# EAGLE design Full_PCB (EAGLE 7.1.0)

## Sheet 1 of 2
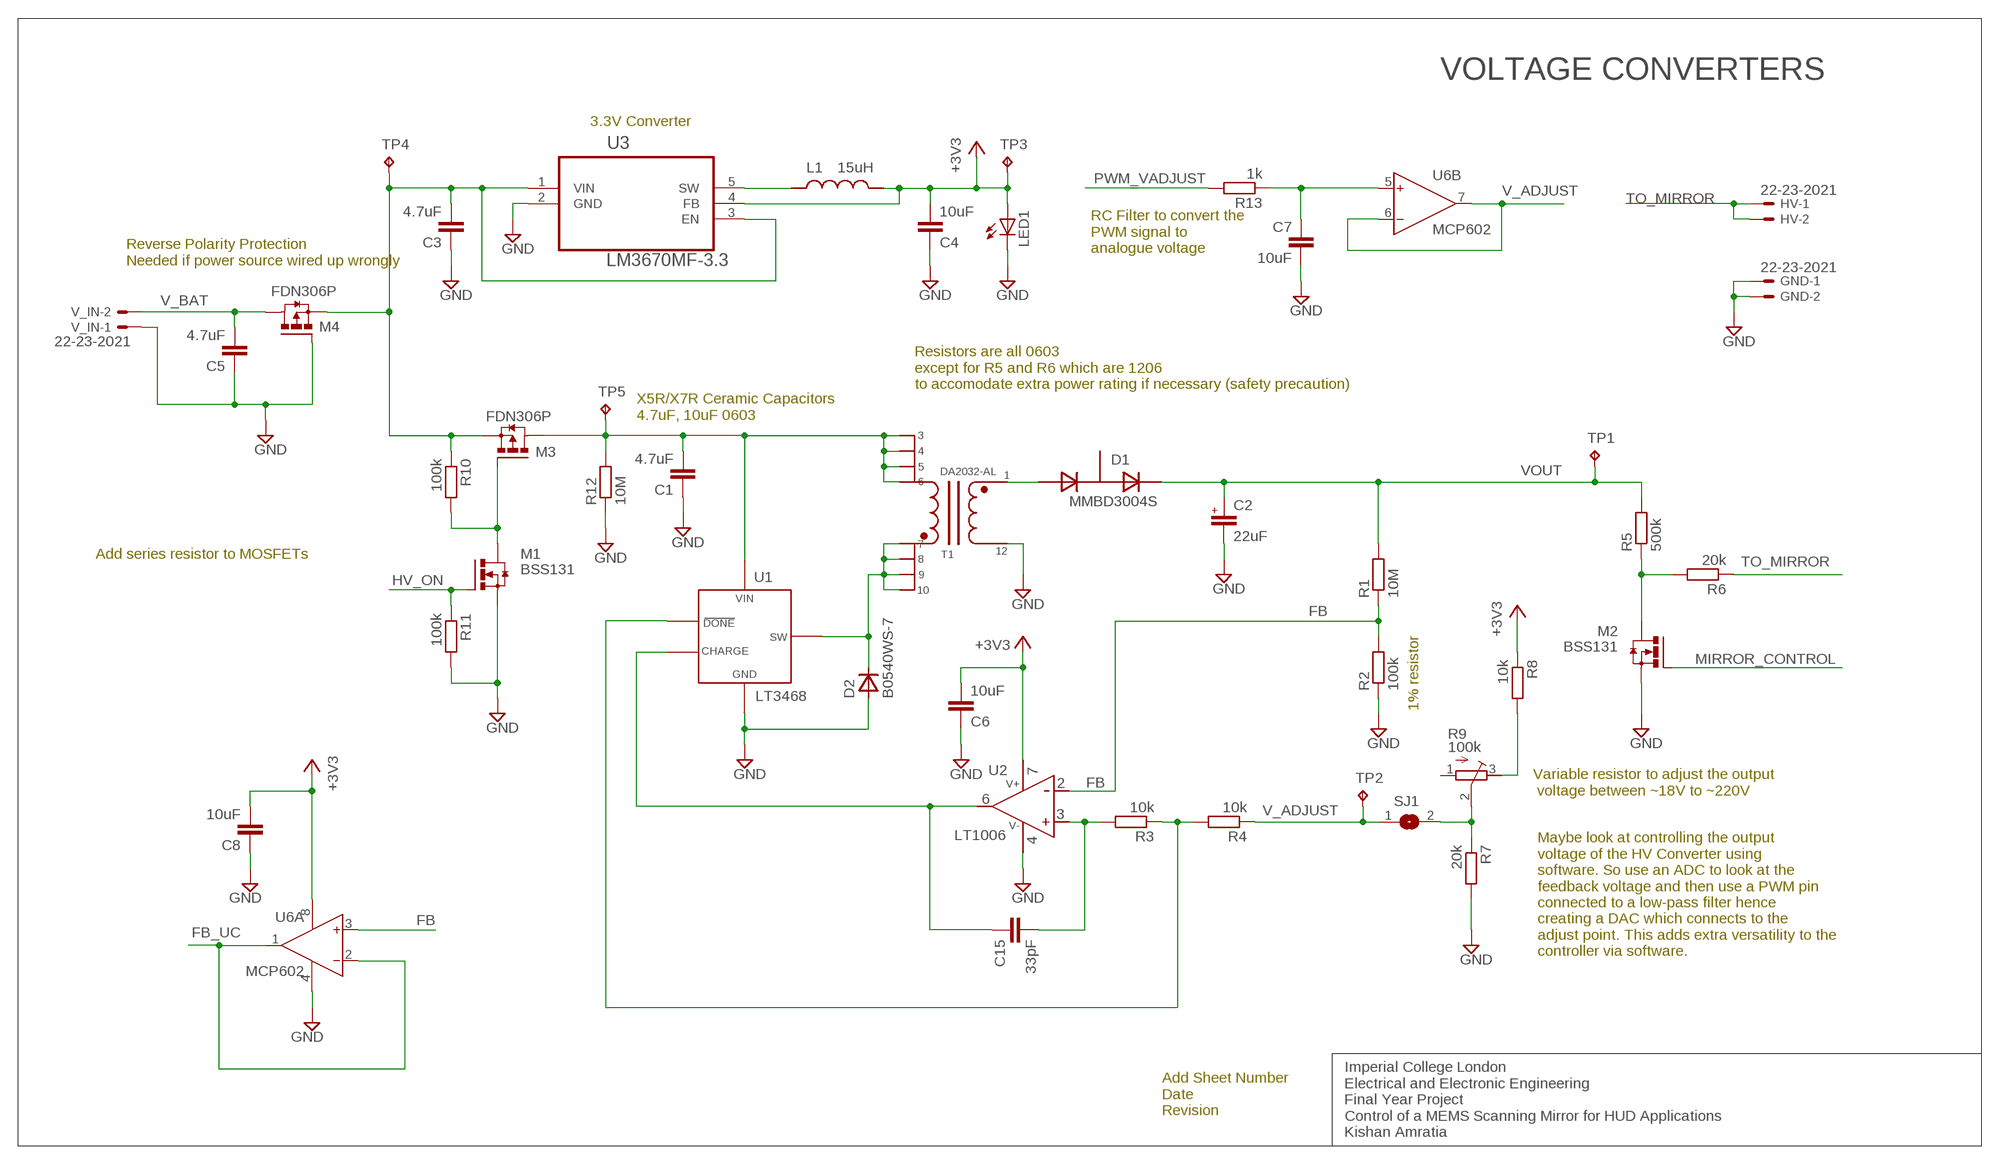
[diagram p0: schematic, sheet 1]

### Parts
C1  4.7uF  C-EUC0603K  [C0603K]
C2  22uF  EEUEE2E220  [5MM-RADIAL-LEAD]
C3  4.7uF  C-EUC0603K  [C0603K]
C4  10uF  C-EUC0603  [C0603]
C5  4.7uF  C-EUC0603K  [C0603K]
C6  10uF  C-EUC0603  [C0603]
C7  10uF  C-EUC0603  [C0603]
C8  10uF  C-EUC0603  [C0603]
C15  33pF  C-EUC0603  [C0603]
D1  MMBD3004S  [SOT-23]
D2  B0540WS-7  [SOD-323]
GND  22-23-2021  [22-23-2021]
HV  22-23-2021  [22-23-2021]
L1  15uH  IFSC1515AHER150M01  [IFSC1515AHER150M01]
LED1  LEDCHIPLED_0603  [CHIPLED_0603]
M1  BSS131  [SOT-23]
M2  BSS131  [SOT-23]
M3  FDN306P  [SSOT-3]
M4  FDN306P  [SSOT-3]
R1  10M  R-EU_R0603  [R0603]
R2  100k  R-EU_R0603  [R0603]
R3  10k  R-EU_R0603  [R0603]
R4  10k  R-EU_R0603  [R0603]
R5  500k  R-EU_R1206  [R1206]
R6  20k  R-EU_R1206  [R1206]
R7  20k  R-EU_R0603  [R0603]
R8  10k  R-EU_R0603  [R0603]
R9  100k  TC33X-2-104E  [TC33X-2-104E]
R10  100k  R-EU_R0603  [R0603]
R11  100k  R-EU_R0603  [R0603]
R12  10M  R-EU_R0603  [R0603]
R13  1k  R-EU_R0603  [R0603]
SJ1  SJ  [SJ]
T1  DA2032-AL  [DA2032-AL]
TP1  TPB1,27  [B1,27]
TP2  TPB1,27  [B1,27]
TP3  TPB1,27  [B1,27]
TP4  TPB1,27  [B1,27]
TP5  TPB1,27  [B1,27]
U1  LT3468  [TSOT-23]
U2  LT1006  [SOIC127P600X175-8N]
U3  LM3670MF-3.3  [SOT95P284X122-5N]
U6  MCP602  [SOIC127P600X175-8N]
V_IN  22-23-2021  [22-23-2021]

### Nets
+3V3: C4.2 C6.2 C8.2 L1.2 LED1.A R8.1 TP3.TP U2.7 U3.4(FB) U6.8(C:V+) ; also sheet 2
FB: R1.1 R2.2 U2.2 U6.3(A:IN+)
FB_UC: U6.1(A:OUT) U6.2(A:IN-) ; also sheet 2
GND: C1.1 C2.2 C3.1 C4.1 C5.1 C6.1 C7.2 C8.1 D2.A GND.1 GND.2 LED1.C M1.K(S) M2.K(S) M4.1(G) R2.1 R7.2 R11.2 R12.1 T1.12 U1.2 U2.4 U3.2(GND) U6.4(C:V-) V_IN.1 ; also sheet 2
HV_ON: M1.A(G) R11.1 ; also sheet 2
MIRROR_CONTROL: M2.A(G) ; also sheet 2
N$1: C7.1 R13.1 U6.5(B:IN+)
N$2: C15.1 U1.4 U2.6
N$3: D1.A T1.1
N$4: R8.2 R9.3
N$5: C1.2 M3.3(D) R12.2 T1.3 T1.4 T1.5 T1.6 TP5.TP U1.5
N$6: R3.1 R4.2 U1.3
N$8: C15.2 R3.2 U2.3
N$9: M2.K1A2(D) R5.1 R6.2
N$10: R7.1 R9.2 SJ1.2
N$12: D2.K T1.7 T1.8 T1.9 T1.10 U1.1
N$13: M1.K1A2(D) M3.1(G) R10.2
N$14: L1.1 U3.5(SW)
PWM_VADJUST: R13.2 ; also sheet 2
TO_MIRROR: HV.1 HV.2 R6.1
V_ADJUST: R4.1 SJ1.1 TP2.TP U6.6(B:IN-) U6.7(B:OUT)
V_BAT: C5.2 M4.3(D) V_IN.2
V_IN: C3.2 M3.2(S) M4.2(S) R10.1 TP4.TP U3.1(VIN) U3.3(EN)
VOUT: C2.1+ D1.K R1.2 R5.2 TP1.TP
Unconnected: D1.K1A2 R9.1

### Notes on the sheet
- VOLTAGE CONVERTERS
- 3.3V Converter
- RC Filter to convert the 
  PWM signal to
  analogue voltage
- Reverse Polarity Protection
  Needed if power source wired up wrongly
- Resistors are all 0603
  except for R5 and R6 which are 1206
  to accomodate extra power rating if necessary (safety precaution)
- X5R/X7R Ceramic Capacitors
  4.7uF, 10uF 0603
- Add series resistor to MOSFETs
- 1% resistor
- Variable resistor to adjust the output
   voltage between ~18V to ~220V
- Maybe look at controlling the output
  voltage of the HV Converter using
  software. So use an ADC to look at the 
  feedback voltage and then use a PWM pin
  connected to a low-pass filter hence
  creating a DAC which connects to the
  adjust point. This adds extra versatility to the
  controller via software.
- Add Sheet Number
  Date
  Revision
- Imperial College London
  Electrical and Electronic Engineering
  Final Year Project
  Control of a MEMS Scanning Mirror for HUD Applications
  Kishan Amratia

## Sheet 2 of 2
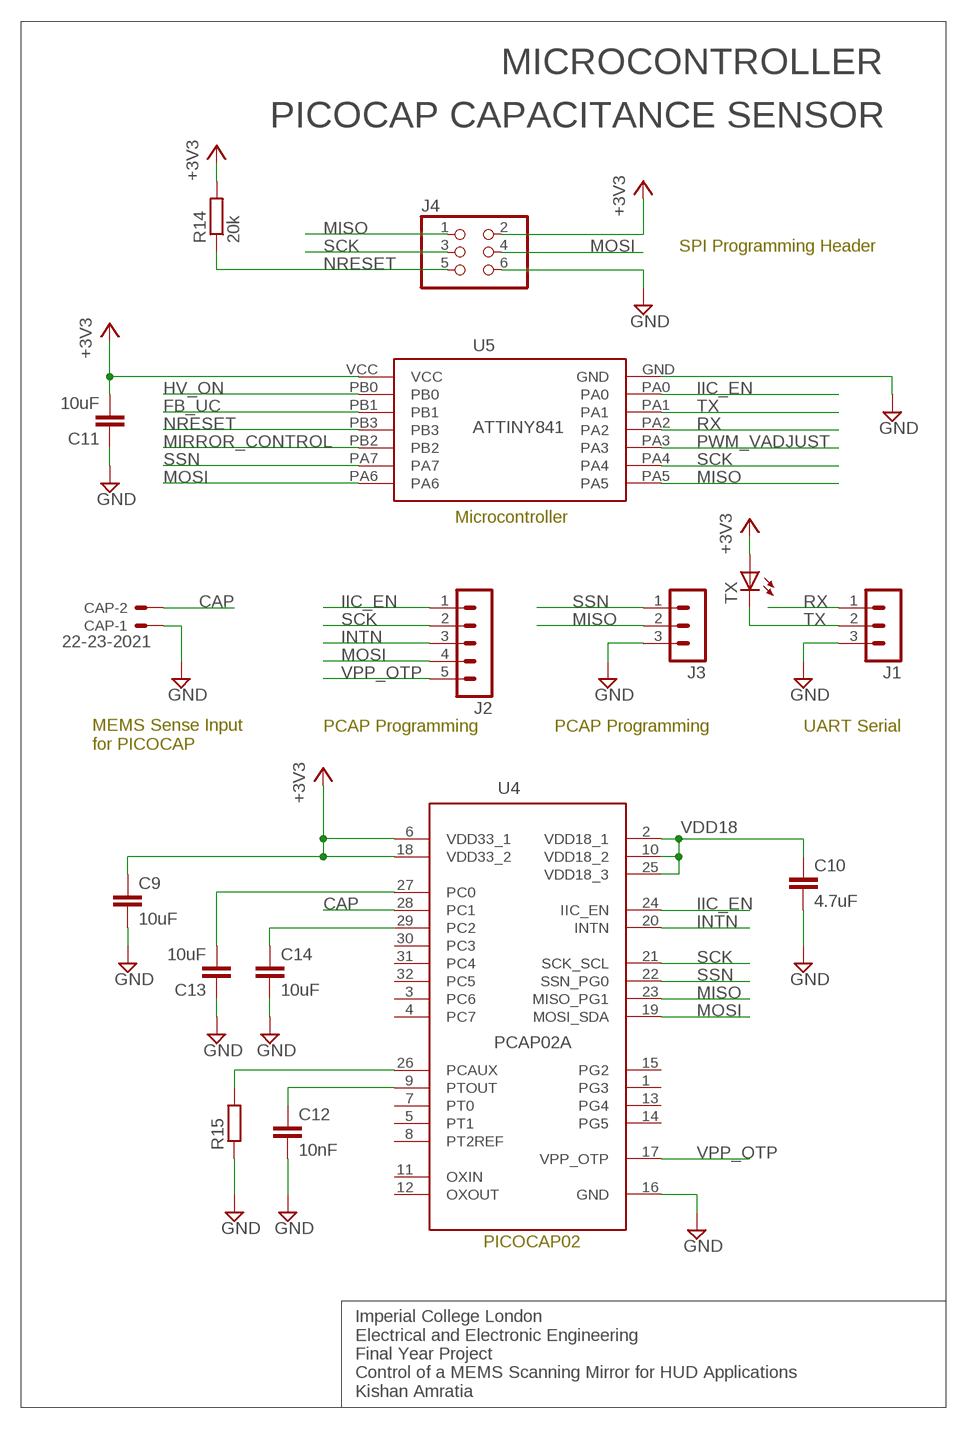
[diagram p1: schematic, sheet 2]

### Parts
C9  10uF  C-EUC0603K  [C0603K]
C10  4.7uF  C-EUC0603K  [C0603K]
C11  10uF  C-EUC0603K  [C0603K]
C12  10nF  C-EUC0603K  [C0603K]
C13  10uF  C-EUC0603K  [C0603K]
C14  10uF  C-EUC0603K  [C0603K]
CAP  22-23-2021  [22-23-2021]
J1  MA03-1  [MA03-1]
J2  MA05-1  [MA05-1]
J3  MA03-1  [MA03-1]
J4  PINHD-2X3  [2X03]
R14  20k  R-EU_R0603  [R0603]
R15  R-EU_R0603  [R0603]
TX  LEDCHIPLED_0603  [CHIPLED_0603]
U4  PCAP02A  [QFN32]
U5  ATTINY841  [SOIC-14]

### Nets
+3V3: C9.1 C11.2 J4.2 R14.2 TX.A U4.6(VDD33_1) U4.18(VDD33_2) U5.VCC ; also sheet 1
CAP: CAP.2 U4.28(PC1)
FB_UC: U5.PB1 ; also sheet 1
GND: C9.2 C10.2 C11.1 C12.2 C13.1 C14.2 CAP.1 J1.3 J3.3 J4.6 R15.1 U4.16(GND) U5.GND ; also sheet 1
HV_ON: U5.PB0 ; also sheet 1
IIC_EN: J2.1 U4.24(IIC_EN) U5.PA0
INTN: J2.3 U4.20(INTN)
MIRROR_CONTROL: U5.PB2 ; also sheet 1
MISO: J3.2 J4.1 U4.23(MISO_PG1) U5.PA5
MOSI: J2.4 J4.4 U4.19(MOSI_SDA) U5.PA6
N$11: C12.1 U4.9(PTOUT)
N$15: R15.2 U4.26(PCAUX)
N$17: C13.2 U4.27(PC0)
N$18: C14.1 U4.29(PC2)
NRESET: J4.5 R14.1 U5.PB3
PWM_VADJUST: U5.PA3 ; also sheet 1
RX: J1.1 U5.PA2
SCK: J2.2 J4.3 U4.21(SCK_SCL) U5.PA4
SSN: J3.1 U4.22(SSN_PG0) U5.PA7
TX: J1.2 TX.C U5.PA1
VDD18: C10.1 U4.2(VDD18_1) U4.10(VDD18_2) U4.25(VDD18_3)
VPP_OTP: J2.5 U4.17(VPP_OTP)
Unconnected: U4.1(PG3) U4.3(PC6) U4.4(PC7) U4.5(PT1) U4.7(PT0) U4.8(PT2REF) U4.11(OXIN) U4.12(OXOUT) U4.13(PG4) U4.14(PG5) U4.15(PG2) U4.30(PC3) U4.31(PC4) U4.32(PC5)

### Notes on the sheet
- MICROCONTROLLER
- PICOCAP CAPACITANCE SENSOR
- SPI Programming Header
- Microcontroller
- PCAP Programming | PCAP Programming | UART Serial
- MEMS Sense Input 
  for PICOCAP
- PICOCAP02
- Imperial College London
  Electrical and Electronic Engineering
  Final Year Project
  Control of a MEMS Scanning Mirror for HUD Applications
  Kishan Amratia

## Library data of the parts
C1 C3-C15 = rcl:C-EU: CAPACITOR, European symbol
C2 = FYP:EEUEE2E220
CAP GND HV V_IN = con-molex:22-23-2021: .100" (2.54mm) Center Header - 2 Pin; MF: MOLEX; MPN: 22-23-2021; OC_FARNELL: 1462926; OC_NEWARK: 25C3832
D1 = FYP:MMBD3004S
D2 = FYP:B0540WS-7
J1 J3 = con-lstb:MA03-1: PIN HEADER; OC_FARNELL: unknown; OC_NEWARK: unknown
J2 = con-lstb:MA05-1: PIN HEADER; OC_FARNELL: unknown; OC_NEWARK: unknown
J4 = pinhead:PINHD-2X3: PIN HEADER
L1 = FYP:IFSC1515AHER150M01
LED1 TX = led:LED: LED OSRAM: - CHIPLED LG R971, LG N971, LY N971, LG Q971, LY Q971, LO R971, LY R971 LH N974, LH R974 LS Q976, LO Q976, LY Q976 LO Q996 - Hyper CHIPLED LW Q18S LB Q993, LB Q99A, LB R99A - SideLED LS A670, LO A670, LY A670, LG A670, LP A670 LB A673, LV A673, LT A673, LW A673 LH A674 LY A675 LS A676, LA A676, LO A676, LY A676, LW A676 LS A679, LY A679, LG A679 - Hyper Micro SIDELED® LS Y876, LA Y876, LO Y876, LY Y876 LT Y87S - SmartLED LW L88C, LW L88S LB L89C, LB L89S, LG L890 LS L89K, LO L89K, LY L89K LS L896, LA L896, LO L896, LY L896 - TOPLED LS T670, LO T670, LY T670, LG T670, LP T670 LSG T670, LSP T670, LSY T670, LOP T670, LYG T670 LG T671, LOG T671, LSG T671 LB T673, LV T673, LT T673, LW T673 LH T674 LS T676, LA T676, LO T676, LY T676, LB T676, LH T676, LSB T676, LW T676 LB T67C, LV T67C, LT T67C, LS T67K, LO T67K, LY T67K, LW E67C LS E67B, LA E67B, LO E67B, LY E67B, LB E67C, LV E67C, LT E67C LW T67C LS T679, LY T679, LG T679 LS T770, LO T770, LY T770, LG T770, LP T770 LB T773, LV T773, LT T773, LW T773 LH T774 LS E675, LA E675, LY E675, LS T675 LS T776, LA T776, LO T776, LY T776, LB T776 LHGB T686 LT T68C, LB T68C - Hyper Mini TOPLED® LB M676 - Mini TOPLED Santana® LG M470 LS M47K, LO M47K, LY M47K Source: http://www.osram.convergy.de LUXEON: - LUMILED® LXK2-PW12-R00, LXK2-PW12-S00, LXK2-PW14-U00, LXK2-PW14-V00 LXK2-PM12-R00, LXK2-PM12-S00, LXK2-PM14-U00 LXK2-PE12-Q00, LXK2-PE12-R00, LXK2-PE12-S00, LXK2-PE14-T00, LXK2-PE14-U00 LXK2-PB12-K00, LXK2-PB12-L00, LXK2-PB12-M00, LXK2-PB14-N00, LXK2-PB14-P00, LXK2-PB14-Q00 LXK2-PR12-L00, LXK2-PR12-M00, LXK2-PR14-Q00, LXK2-PR14-R00 LXK2-PD12-Q00, LXK2-PD12-R00, LXK2-PD12-S00 LXK2-PH12-R00, LXK2-PH12-S00 LXK2-PL12-P00, LXK2-PL12-Q00, LXK2-PL12-R00 Source: www.luxeon.com KINGBRIGHT: KA-3528ASYC Source: www.kingbright.com
M1 M2 = FYP:BSS131
M3 M4 = FYP:FDN306P
R1-R8 R10-R15 = rcl:R-EU_: RESISTOR, European symbol
R9 = FYP:TC33X-2-104E
SJ1 = jumper:SJ: SMD solder JUMPER
T1 = FYP:DA2032-AL
TP1-TP5 = testpad:TP: Test pad
U1 = FYP:LT3468
U2 = FYP:LT1006
U3 = FYP:LM3670MF-3.3: IC BUCK 3.3V 350MA; MPN: LM3670MF-3.3; OC_FARNELL: 1685757; OC_NEWARK: 65K6211; PACKAGE: 5-SOT-23; SUPPLIER: NationalSemiconductor
U4 = FYP:PCAP02A
U5 = FYP:ATTINY841
U6 = FYP:MCP602

## Board
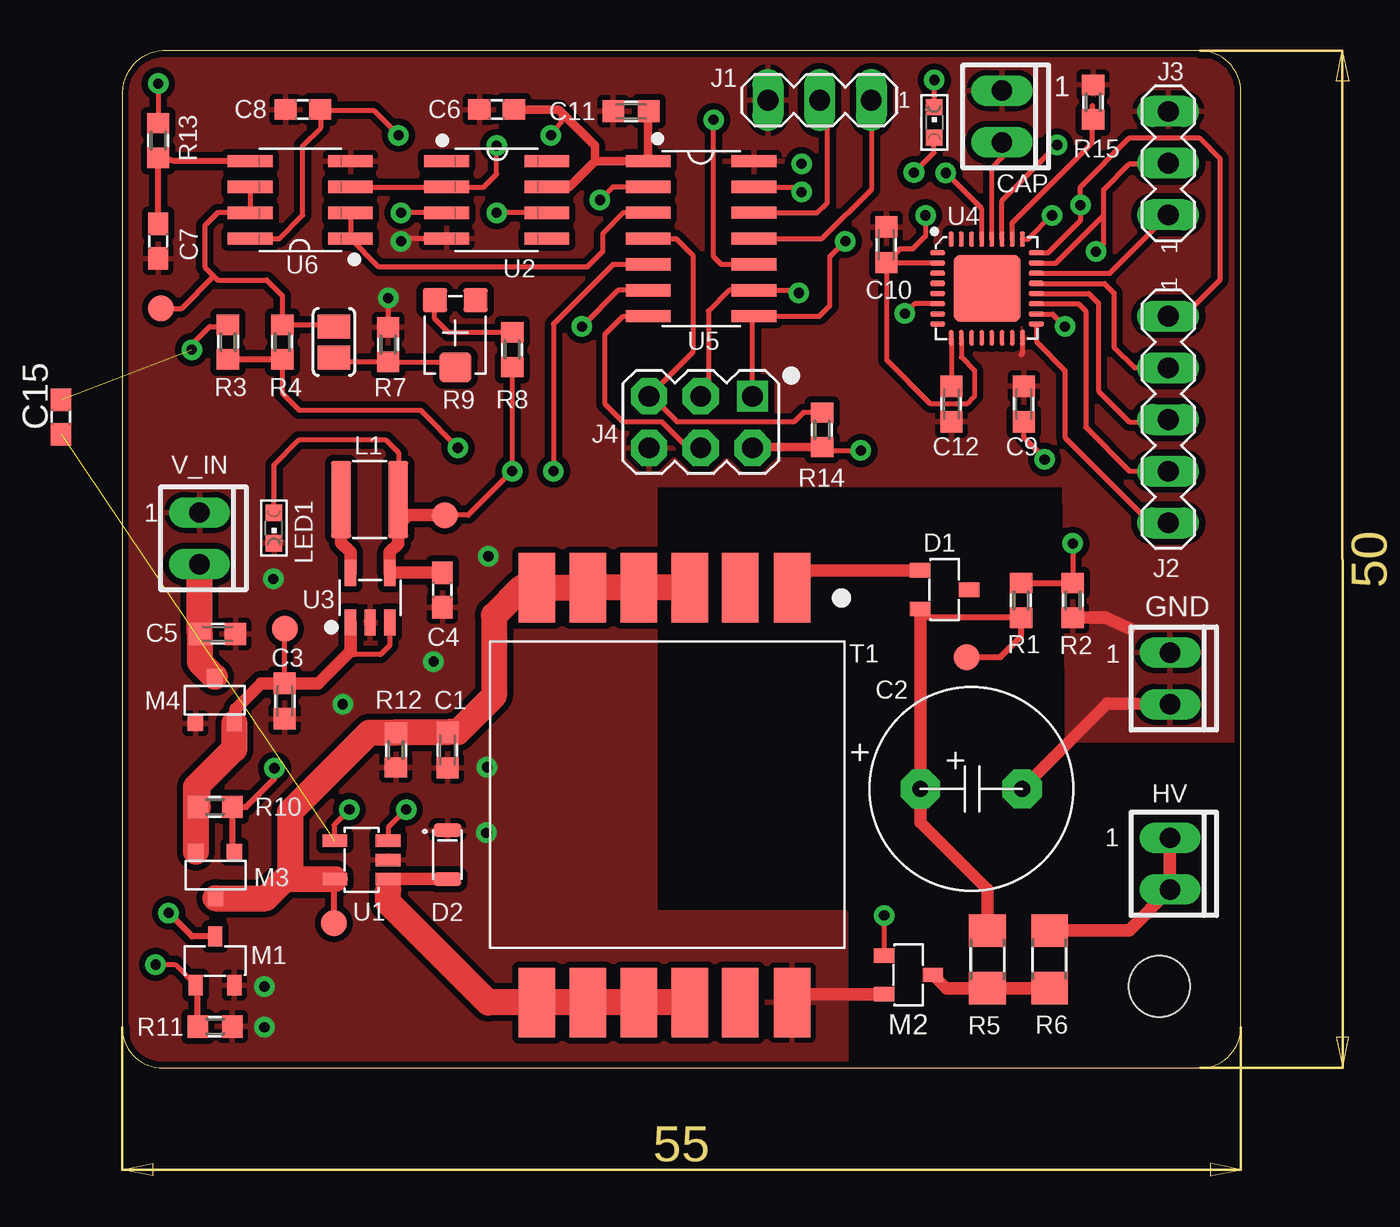
[diagram p2: board, top side]
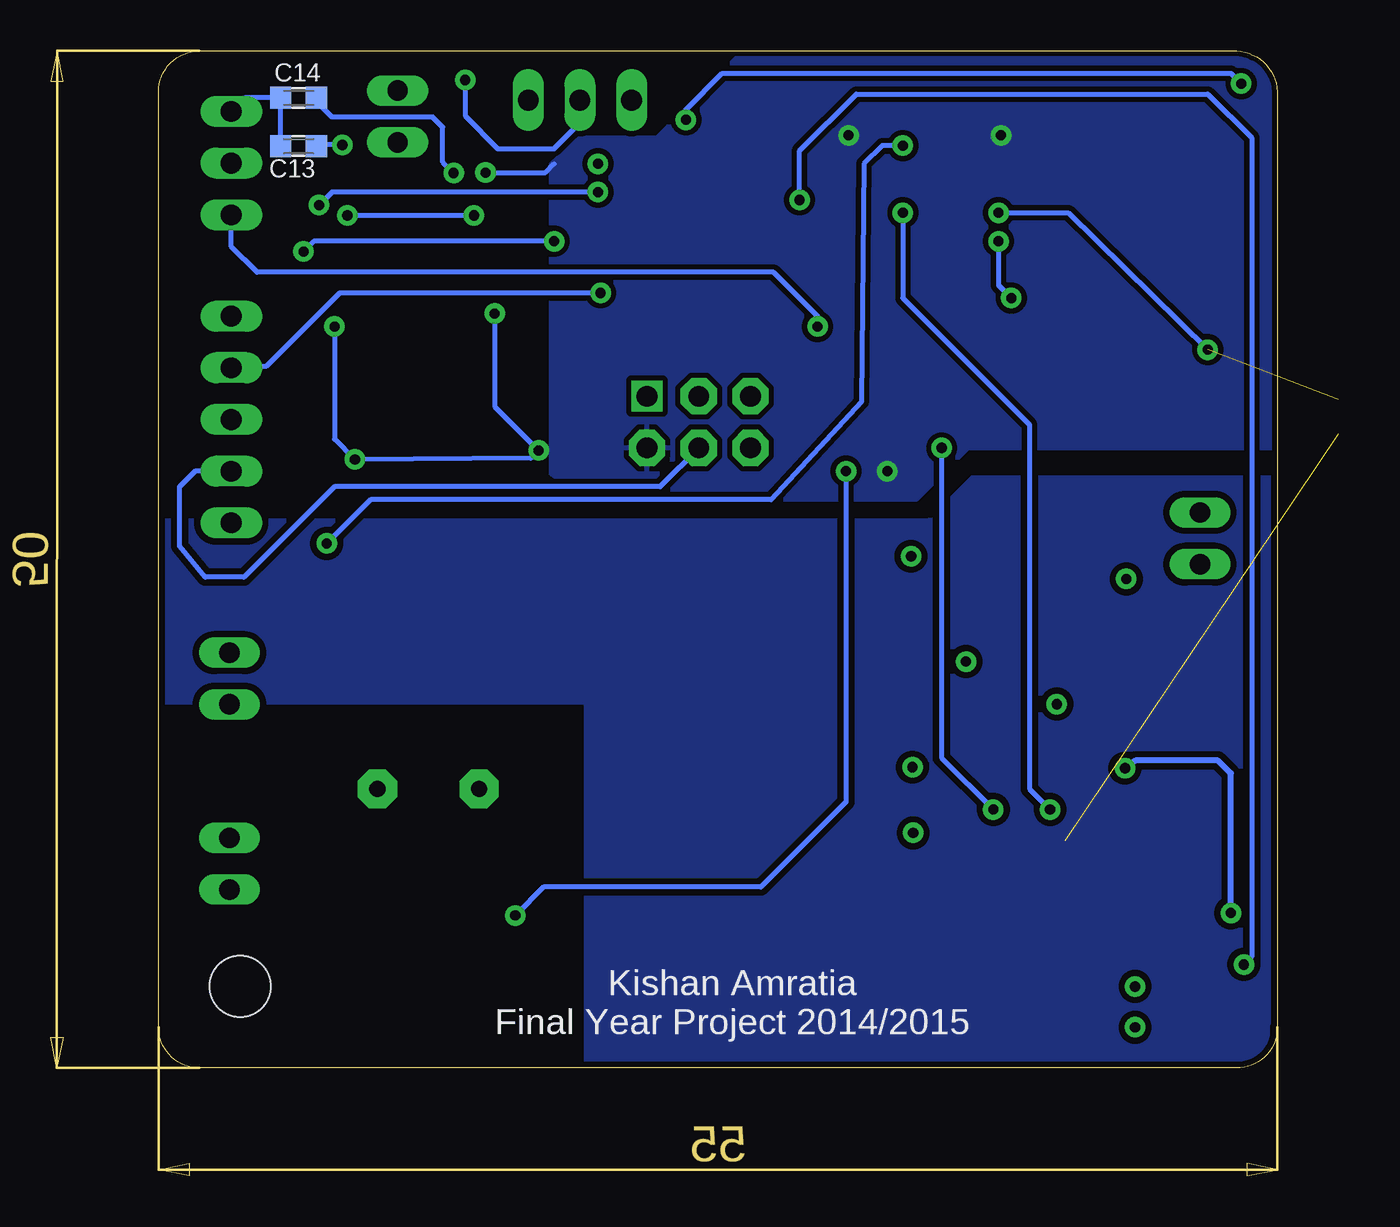
[diagram p3: board, bottom side, seen from below]

Size 55 x 50 mm. Coordinates in mm from the lower left corner, seen from the top.
Outline: 2,0 53,0 arc90 55,2.02 55,47.98 arc90 53,50 2,50 arc84 0,48 0,2 arc90 2,0
Copper layers (1*16): Top 0.035mm / dielectric 1.5mm / Bottom 0.035mm
Design rules "pcbtrain *": minimum track width 0.2mm, minimum drill 0.4mm, track to track 0.2mm, track to pad 0.2mm, pad to pad 0.2mm, via to via 0.3mm, smd to smd 0mil, copper to edge 10mil, drill to drill 0.2mm, minimum pad ring 10mil, minimum via ring 10mil, stop-mask expansion 0.125mm, vias tented up to drill 0mil, thermal gap 10mil
Holes 3 mm at 51,4

### Footprints (pad centres in the part's own frame; a part is rotated, then mirrored left to right if it is on the bottom)
C0603K = smd 1.05 x 1.08: 1 -0.875,0; 2 0.875,0
5MM-RADIAL-LEAD = drill 0.8 pad 1.93 octagon: 1+ 0,0; 2 5,0
C0603 = smd 1.1 x 1: 1 -0.85,0; 2 0.85,0
22-23-2021 = drill 1 long: 1 -1.27,0; 2 1.27,0
SOT-23 = smd 0.7 x 1: A -0.95,0; K 0.95,0; K1A2 0,2.4
SOD-323 = smd 0.65 x 1.35: A 0,0; K 2.4,0
MA03-1 = drill 1.016 long: 1 -2.54,0; 2 0,0; 3 2.54,0
MA05-1 = drill 1.016 long: 1 -5.08,0; 2 -2.54,0; 3 0,0; 4 2.54,0; 5 5.08,0
2X03 = drill 1.016 square: 1 -2.54,-1.27 | drill 1.016 pad 1.778 octagon: 2 -2.54,1.27; 3 0,-1.27; 4 0,1.27; 5 2.54,-1.27; 6 2.54,1.27
IFSC1515AHER150M01 = smd 1 x 3.8: 1 -1.42,-0.127; 2 1.38,-0.127
CHIPLED_0603 = smd 0.8 x 0.8: A 0,-0.75; C 0,0.75
SSOT-3 = smd 0.76 x 0.76: 1 -0.96,-1.1; 2 0.94,-1.1; 3 -0.01,1.19
R0603 = smd 1 x 1.1: 1 -0.85,0; 2 0.85,0
R1206 = smd 1.6 x 1.803: 1 -1.422,0; 2 1.422,0
TC33X-2-104E = smd 1.2 x 1.2: 1 -1,-1.8; 3 1,-1.8 | smd 1.6 x 1.5: 2 0,1.5
SJ = smd 1.168 x 1.6: 1 -0.762,0; 2 0.762,0
DA2032-AL = smd 3.4 x 1.79: 1 -10,7.54; 2 -10,5; 3 -10,2.5; 4 -10,0; 5 -10,-2.5; 6 -10,-5; 7 10.395,-5; 8 10.395,-2.5; 9 10.395,0; 10 10.395,2.5; 11 10.395,5; 12 10.395,7.54
B1,27 = smd 1.27 x 1.27: TP 0,0
TSOT-23 = smd 1.22 x 0.62: 1 -1.27,0.89; 2 -1.27,-0.06; 3 -1.27,-1.01; 4 1.35,-1.01; 5 1.35,0.89
SOIC127P600X175-8N = smd 2.2 x 0.6: 1 -2.464,1.905; 2 -2.464,0.635; 3 -2.464,-0.635; 4 -2.464,-1.905; 5 2.464,-1.905; 6 2.464,-0.635; 7 2.464,0.635; 8 2.464,1.905
SOT95P284X122-5N = smd 1.27 x 0.559: 1 -1.219,0.965; 2 -1.219,0; 3 -1.219,-0.965; 4 1.219,-0.965; 5 1.219,0.965
QFN32 = smd 0.25 x 0.75: 1 0,0; 2 0.5,0; 3 1,0; 4 1.5,0; 5 2,0; 6 2.5,0; 7 3,0; 8 3.5,0; 17 3.5,4.85; 18 3,4.85; 19 2.5,4.85; 20 2,4.85; 21 1.5,4.85; 22 1,4.85; 23 0.5,4.85; 24 0,4.85 | smd 0.75 x 0.25: 9 4.18,0.66; 10 4.18,1.16; 11 4.18,1.66; 12 4.18,2.16; 13 4.18,2.66; 14 4.18,3.16; 15 4.18,3.66; 16 4.18,4.16; 25 -0.67,4.16; 26 -0.67,3.66; 27 -0.67,3.16; 28 -0.67,2.66; 29 -0.67,2.16; 30 -0.67,1.66; 31 -0.67,1.16; 32 -0.67,0.66 | smd 3.3 x 3.3: P$33 1.75,2.43
SOIC-14 = smd 0.6 x 2.2: GND -3.7,2.65; PA0 -2.43,2.65; PA1 -1.16,2.65; PA2 0.11,2.65; PA3 1.38,2.65; PA4 2.65,2.65; PA5 3.92,2.65; PA6 3.92,-2.55; PA7 2.65,-2.55; PB0 -2.43,-2.55; PB1 -1.16,-2.55; PB2 1.38,-2.55; PB3 0.11,-2.55; VCC -3.7,-2.55

### Placement (x,y rotation side)
C1  16,15.62 90 top
C2  39.24,13.72 0 top
C3  8,18.03 90 top
C4  15.75,23.5 90 top
C5  4.7,21.34 180 top
C6  18.41,47.12 0 top
C7  1.78,40.64 270 top
C8  8.89,47.12 0 top
C9  44.32,32.64 90 top
C10  37.57,40.46 90 top
C11  25.02,47.02 0 top
C12  40.77,32.64 270 top
C13  48.12,45.31 0 bottom
C14  48.12,47.69 180 bottom
C15  -3,32 90 top
CAP  43.25,46.77 270 top
D1  39.24,23.51 270 top
D2  16,11.68 270 top
GND  51.52,19.15 270 top
HV  51.52,10.03 270 top
J1  34.29,47.58 180 top
J2  51.44,31.88 270 top
J3  51.44,44.48 90 top
J4  28.45,31.75 180 top
L1  12.19,28.07 0 top
LED1  7.47,26.54 180 top
M1  4.57,4.06 0 top
M2  37.47,4.57 270 top
M3  4.57,9.53 180 top
M4  4.57,18.03 0 top
R1  44.2,22.99 270 top
R2  46.74,22.99 90 top
R3  5.21,35.69 90 top
R4  7.87,35.69 270 top
R5  42.55,5.33 90 top
R6  45.59,5.33 270 top
R7  13.08,35.56 90 top
R8  19.18,35.31 90 top
R9  16.38,35.94 180 top
R10  4.57,12.83 0 top
R11  4.57,2.03 0 top
R12  13.46,15.62 90 top
R13  1.78,45.59 90 top
R14  34.42,31.37 270 top
R15  47.74,47.47 270 top
SJ1  10.41,35.69 270 top
T1  25.4,13.61 270 top
TP1  41.53,20.19 0 top
TP2  1.91,37.34 180 top
TP3  15.88,27.18 0 top
TP4  8,21.59 180 top
TP5  10.41,7.11 180 top
TX  39.93,46.48 0 top
U1  11.81,10.16 180 top
U2  18.41,42.67 0 top
U3  12.19,23.11 90 top
U4  40.1,40.07 270 top
U5  28.42,40.88 270 top
U6  8.76,42.67 180 top
V_IN  3.81,26.04 270 top

### Tracks (layer width: path | path; a pad name or v marks a point on that pad's centre or on a via)
+3V3  (via drill 0.5 pad 0.61)
  Top 0.254: U6.8 7.75,40.77 8.89,41.91 8.89,45.34 9.78,46.23 9.78,47.08 | 9.78,47.08 C8.2 | R8.1 v19.18,29.34 17.02,27.18 TP3.TP | U4.18 45.74,37.07 v46.35,36.45 | R14.2 34.58,30.35 v36.32,30.35 | U4.6 38.97,37.57 v38.48,37.08 | 9.78,47.08 12.36,47.08 v13.59,45.85 | 21.59,46.99 21.59,46.48 v21.08,45.85 | LED1.A 7.47,29.64 8.69,30.86 12.98,30.86 13.61,30.23 13.61,28.98 13.59,28.96 13.59,27.96 L1.2 | v38.93,44.02 39.91,44.99 39.91,45.72 TX.A | v45.35,29.91 45.41,29.91 44.32,31 C9.1
  Top 0.406: R14.2 31.03,30.52 J4.2 | U2.7 21.97,43.31 23.24,44.58 | 23.24,44.58 U5.VCC 25.87,46.99 C11.2 | C6.2 21.46,47.12 21.59,46.99 23.24,45.34 23.24,44.58
  Top 0.61: L1.2 13.57,26.67 | 13.57,26.67 13.57,25.76 13.16,25.35 U3.4 13.17,24.34 C4.2 | TP3.TP 14.08,27.18 13.57,26.67
  Bottom 0.254: v38.48,37.08 38.48,32.51 v36.32,30.35 36.7,29.97 v45.35,29.91 46.35,30.91 v46.35,36.45 | v19.18,29.34 19.05,29.21 | v13.59,45.85 13.84,45.85 13.97,45.72 | v21.08,45.85 21.21,46.1 | v38.93,44.02 35.99,44.02 35.56,44.45
  pour Bottom (isolate 0.254): 0,30.48 15.24,30.48 17.78,27.94 34.29,27.94 35.69,29.21 35.69,44.45 34.29,45.72 30.48,45.72 26.24,49.99 2,49.99 arc90 0,47.99
CAP
  Top 0.254: CAP.2 43.26,44.74 42.76,44.24 U4.28
FB  (via drill 0.5 pad 0.61)
  Top 0.254: U6.3 U2.2 17.78,43.31 18.41,43.94 v18.41,45.34 | v46.74,25.78 R2.2
  Top 0.305: R1.1 R2.2
  Bottom 0.254: v18.41,45.34 19.43,45.34 20.32,44.45 20.45,32.77 24.89,27.94 44.58,27.94 v46.74,25.78
FB_UC
  Top 0.254: U6.2 U6.1 12.62,39.37 22.86,39.37 23.62,40.13 23.62,41.02 24.64,42.04 U5.PB1
GND  (via drill 0.5 pad 0.61)
  Top 0.254: U4.16 44.26,35.12 44.2,35.05 | U2.4 14.1,40.77 v13.72,40.64 | v13.08,37.85 R7.2
  Top 0.61: M2.K 33.53,3.62 T1.12 | R2.1 48.35,22.14 49.53,21.59 | GND.2 48.43,17.91 C2.2
  Bottom 0.254: v13.72,40.64 13.72,38.48 v13.08,37.85 | C13.1 C14.2 50.77,47.69 J3.3
  other vias: 7,2 7,4 17.91,11.56 17.94,14.78 7.43,24.04 15.31,19.97 10.85,17.88 18.01,25.15
  pour Top (isolate 0.305): 2,49.99 52.99,49.99 arc-90 54.99,47.99 54.99,16.13 46.48,16.13 46.48,18.67 46.35,28.69 26.21,28.69 26.21,7.62 35.56,7.62 35.59,0 2,0 arc-90 0,2 0,47.99 arc-90
HV_ON  (via drill 0.5 pad 0.61)
  Top 0.254: U5.PB0 25.53,43.31 | 25.53,43.31 25.4,43.18 | 25.53,43.31 24.13,43.31 v23.5,42.67 | v1.65,5.08 2.61,5.08 M1.A
  Top 0.305: R11.1 3.72,3.96 M1.A
  Bottom 0.254: v23.5,42.67 23.5,45.09 20.7,47.88 3.43,47.88 1.27,45.72 1.27,5.46 v1.65,5.08
IIC_EN  (via drill 0.5 pad 0.61)
  Top 0.254: U4.24 45.53,40.07 47.12,41.66 v47.12,42.42 47.12,43.31 49.53,45.72 52.96,45.72 53.98,44.7 53.98,38.73 52.07,36.83 51.56,36.83 J2.1 | U5.PA0 33.15,43.31 v33.4,43.05
  Bottom 0.254: v33.4,43.05 46.48,43.05 v47.12,42.42
INTN
  Top 0.254: U4.20 47.53,38.07 48.01,37.59 48.01,33.27 49.53,31.75 51.31,31.75 J2.3
MIRROR_CONTROL  (via drill 0.5 pad 0.61)
  Top 0.254: U5.PB2 24.13,39.5 21.21,36.58 v21.21,29.34 | v37.47,7.49 M2.A
  Bottom 0.254: v21.21,29.34 21.21,13.08 25.4,8.89 36.07,8.89 v37.47,7.49
MISO  (via drill 0.5 pad 0.61)
  Top 0.254: J4.1 30.99,36.63 U5.PA5 34.29,36.96 34.8,37.47 34.8,39.88 v35.56,40.64 | U4.23 45.92,39.57 48.26,41.91 | 48.26,41.91 48.26,43.18 49.53,44.45 51.28,44.45 J3.2 | v47.88,40.13 48.26,40.51 48.26,41.91
  Bottom 0.254: v35.56,40.64 47.37,40.64 v47.88,40.13
MOSI
  Top 0.254: J4.4 27.81,30.48 26.54,31.75 24.64,31.75 23.75,32.64 23.75,36.07 24.64,36.96 26.12,36.96 U5.PA6 | U4.19 47.01,37.57 47.37,37.21 47.37,31.5 49.53,29.34 J2.4
  Bottom 0.254: J4.4 30.35,28.57 46.35,28.57 50.8,24.13 52.7,24.13 53.98,25.65 53.98,28.57 53.21,29.34 J2.4
N$1
  Top 0.305: C7.1 R13.1 2.58,44.58 U6.5
N$2  (via drill 0.5 pad 0.61)  (1 unrouted)
  Top 0.254: U2.6 v18.41,42.04 | v11.18,12.7 10.41,11.94 10.41,11.22 U1.4
  Bottom 0.254: v18.41,42.04 18.41,37.85 12.19,31.62 12.19,13.72 v11.18,12.7
N$3
  Top 0.61: T1.1 33.8,24.46 D1.A
N$4
  Top 0.254: R8.2 16.04,36.16 15.37,36.83 15.37,37.73 R9.3
N$5
  Top 0.305: TP5.TP 10.41,9.22 U1.5
  Top 1.27: U1.5 8,9.27 | M3.3 7.07,8.34 8,9.27 | 8,9.27 8.26,9.53 8.26,12.57 12.15,16.47 R12.2 13.49,16.5 C1.2 16.02,16.51 16.51,16.51 18.29,18.29 18.29,22.24 19.65,23.61 T1.6 T1.5 T1.4 T1.3
N$6  (via drill 0.5 pad 0.61)
  Top 0.254: R4.2 7.87,33.17 8.71,32.33 14.68,32.33 v16.51,30.48 | v13.97,12.7 13.08,11.81 U1.3
  Top 0.305: R3.1 R4.2
  Bottom 0.254: v16.51,30.48 16.51,15.24 v13.97,12.7
N$7  (via drill 0.5 pad 0.61)
  other vias: 33.4,44.45
N$8  (via drill 0.5 pad 0.61)  (1 unrouted)
  Top 0.254: U2.3 v13.72,42.04 | v3.43,35.31 3.43,35.56 4.32,36.45 5.12,36.45 R3.2
  Bottom 0.254: v13.72,42.04 10.29,42.04 v3.43,35.31
N$9
  Top 0.61: R6.2 R5.1 40.52,3.91 M2.K1A2
N$10
  Top 0.254: SJ1.2 10.63,34.71 R7.1 16.11,34.71 R9.2
N$11
  Top 0.254: U4.9 40.76,33.52 C12.1
N$12
  Top 0.305: U1.1 13.08,8.76
  Top 0.61: D2.K 13.1,9.28 U1.1
  Top 1.27: T1.10 T1.9 T1.8 T1.7 18,3.21 13.08,8.13 13.08,8.76
N$13  (via drill 0.5 pad 0.61)
  Top 0.305: M3.1 5.42,10.73 R10.2 6.1,12.83 7.49,14.22 v7.49,14.73 | M1.K1A2 3.44,6.46 v2.29,7.62
  Bottom 0.305: v2.29,7.62 2.29,14.48 2.92,15.11 6.99,15.11 v7.49,14.73
N$14
  Top 0.61: U3.5 11.23,25.35 10.77,25.8 L1.1
N$15
  Top 0.254: U4.26 43.76,41.55 47.7,45.49 47.7,47.32 R15.2
N$16
  pour Bottom (isolate 0.305): 0,29 15,29 17.12,26.88 54.99,26.88 55,18 33.99,17.99 33.99,0 2,0 arc-90 0,2
N$17  (via drill 0.5)
  Top 0.254: U4.27 43.26,42.63 v45.97,45.38
  Bottom 0.254: v45.97,45.38 47,45.38 | 47,45.38 47.38,45.38 | C13.2 47.06,45.31 47,45.38
N$18  (via drill 0.5)
  Top 0.254: U4.29 42.26,42.24 v40.5,44
  Bottom 0.254: v40.5,44 41.03,44.53 41.03,46.25 41.53,46.75 46.47,46.75 47.25,47.53 C14.1
NRESET
  Top 0.254: R14.1 33.49,32.22 33.02,31.75 27.3,31.75 26.04,33.02 J4.5 28.07,35.18 28.07,39.93 27.23,40.77 U5.PB3
PWM_VADJUST  (via drill 0.5 pad 0.61)
  Top 0.254: U5.PA3 29.46,39.5 29.08,39.88 v29.08,46.61 | v1.78,48.39 R13.2
  Bottom 0.254: v29.08,46.61 29.08,47.12 27.3,48.9 2.29,48.9 v1.78,48.39
RX
  Top 0.254: J1.1 36.83,43.18 34.42,40.77 U5.PA2
SCK  (via drill 0.5 pad 0.61)
  Top 0.254: J4.3 28.83,33.4 28.83,37.21 29.85,38.23 U5.PA4 33.15,38.23 v33.27,38.1 | U4.21 48.3,38.57 48.77,38.1 48.77,35.43 49.78,34.42 J2.2
  Bottom 0.254: J2.2 51.37,34.48 49.72,34.48 46.1,38.1 v33.27,38.1
SSN  (via drill 0.5 pad 0.61)
  Top 0.254: U4.22 48.56,39.07 J3.1 | U5.PA7 24.39,38.23 v22.61,36.45
  Bottom 0.254: 22.61,36.58 v22.61,36.45 22.61,36.96 24.77,39.12 50.16,39.12 51.44,40.39 J3.1
TO_MIRROR
  Top 0.61: HV.1 HV.2 49.51,6.76 R6.1
TX  (via drill 0.5 pad 0.61)
  Top 0.254: U5.PA1 34.16,42.04 34.67,42.55 34.67,47.2 J1.2 | TX.C v39.93,48.56
  Bottom 0.254: v39.93,48.56 39.93,46.81 38.33,45.19 35.56,45.19 34.29,46.46 J1.2
V_ADJUST
  Top 0.254: U6.6 U6.7 4.7,42.04 4.06,41.4 4.06,39.37 4.51,38.92 | 4.51,38.92 4.7,38.73 7.11,38.73 7.87,37.97 R4.1 10.33,36.54 SJ1.1 | TP2.TP 2.92,37.34 4.51,38.92
V_BAT
  Top 1.27: V_IN.2 3.82,24.27 C5.2 3.82,19.96 M4.3
V_IN
  Top 0.254: C3.2 TP4.TP | U3.3 13.16,20.78 12.7,20.32 11.4,20.32 11.23,20.5
  Top 0.61: U3.1 11.23,20.5 9.64,18.91 C3.2 6.84,18.91 5.59,17.65 5.59,17.01 M4.2
  Top 1.27: M4.2 5.51,15.67 3.72,13.88 | R10.1 3.72,13.88 | M3.2 3.63,13.79 3.72,13.88
VDD18  (via drill 0.5 pad 0.61)
  Top 0.254: U4.2 37.97,39.57 C10.1 | U4.10 41.26,34.94 41.91,34.29 41.91,33.02 41.53,32.64 39.75,32.64 37.59,34.8 37.59,39.94 C10.1 | U4.25 44.55,40.74 v45.72,41.91 | v39.5,41.91 39.5,40.89 38.86,40.26 38.24,40.26 C10.1
  Bottom 0.254: v45.72,41.91 v39.5,41.91
VOUT
  Top 0.305: TP1.TP 43.18,20.19 44.2,21.21 R1.2 39.67,22.14 D1.K
  Top 0.61: R5.2 42.55,8.76 39.24,12.06 C2.1+ D1.K
VPP_OTP
  Top 0.254: U4.17 44.95,35.7 46.35,34.29 46.35,30.99 50.55,26.8 J2.5

### Text on the board
tPlace: 1 | 1 | 1 | 1
bPlace: Kishan Amratia / Final Year Project 2014/2015